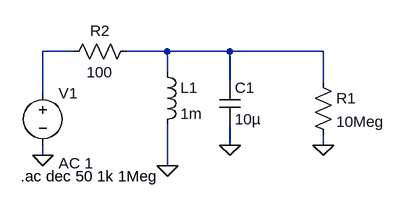
[diagram p0: schematic Draft1.asc]
Draft1.asc, the LTspice schematic file:
Version 4
SHEET 1 880 680
WIRE 16 144 -32 144
WIRE 160 144 96 144
WIRE 256 144 160 144
WIRE 400 144 256 144
WIRE 160 176 160 144
WIRE 256 192 256 144
WIRE 400 192 400 144
WIRE -32 208 -32 144
WIRE 256 288 256 256
WIRE 400 288 400 272
WIRE -32 304 -32 288
WIRE 160 320 160 256
FLAG 400 288 0
FLAG -32 304 0
FLAG 256 288 0
FLAG 160 320 0
SYMBOL res 384 176 R0
SYMATTR InstName R1
SYMATTR Value 10Meg
SYMBOL voltage -32 192 R0
WINDOW 123 24 124 Left 2
WINDOW 39 0 0 Left 0
SYMATTR InstName V1
SYMATTR Value ""
SYMATTR Value2 AC 1
SYMBOL ind 144 160 R0
SYMATTR InstName L1
SYMATTR Value 1m
SYMBOL cap 240 192 R0
SYMATTR InstName C1
SYMATTR Value 10µ
SYMBOL res 112 128 R90
WINDOW 0 0 56 VBottom 2
WINDOW 3 32 56 VTop 2
SYMATTR InstName R2
SYMATTR Value 100
TEXT -66 336 Left 2 !.ac dec 50 1k 1Meg

The netlist it stands for:
* Draft1.asc
R1 N002 0 10Meg
V1 N001 0 AC 1
L1 N002 0 1m
C1 N002 0 10µ
R2 N002 N001 100
.ac dec 50 1k 1Meg
.backanno
.end